# EAGLE design kilafors_rev_a (EAGLE 6.6.0)
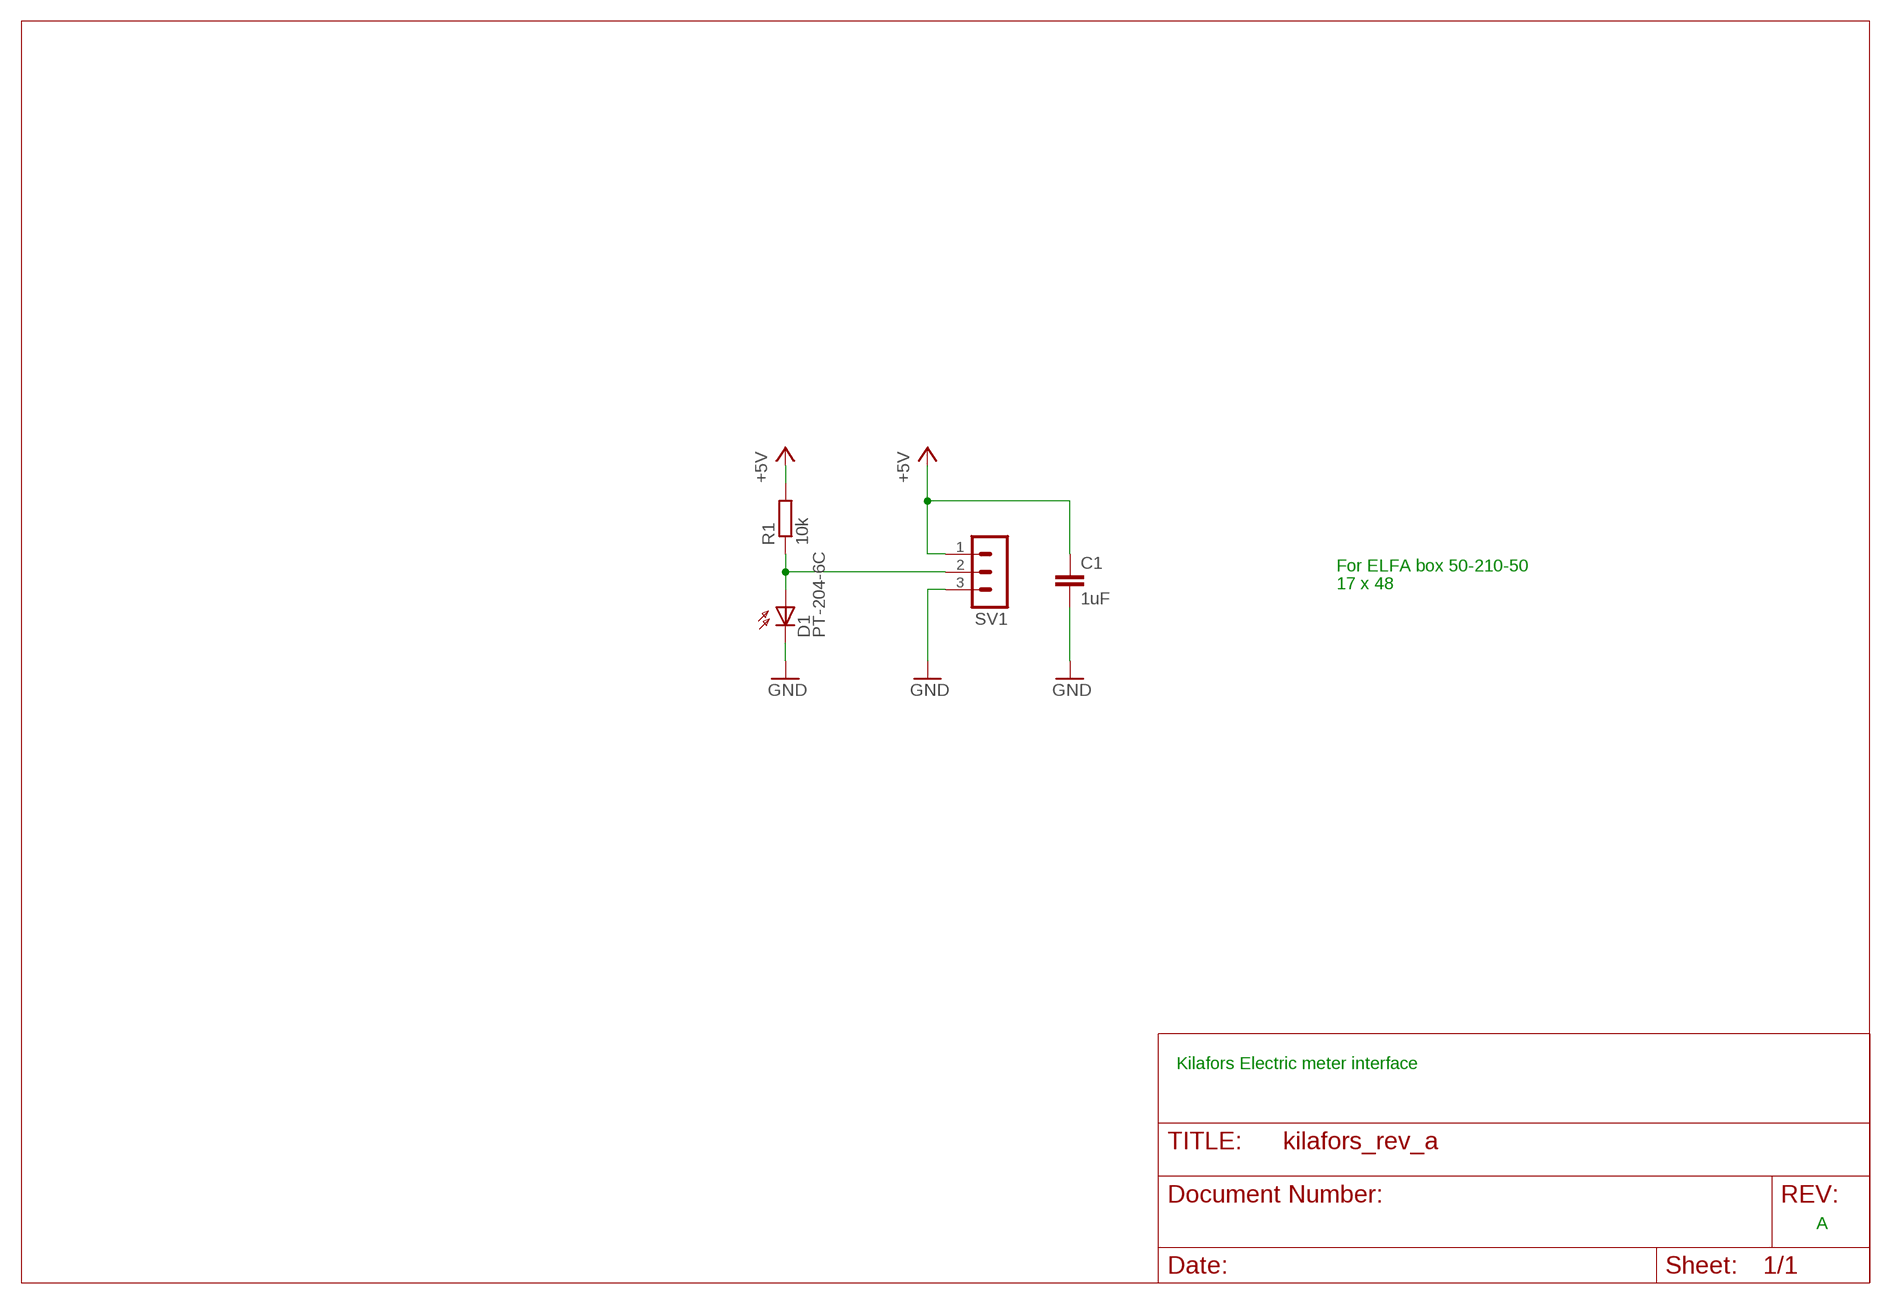
[diagram p0: schematic, sheet 1]

## Parts
C1  1uF  C-EUC0805  [C0805]
D1  PT-204-6C  BP104  [BP104]
R1  10k  R-EU_R0805  [R0805]
SV1  MA03-1  [MA03-1]

## Nets
+5V: C1.1 R1.2 SV1.1
GND: C1.2 D1.K(C) SV1.3
N$1: D1.A R1.1 SV1.2

## Notes on the sheet
- For ELFA box 50-210-50
- 17 x 48
- Kilafors Electric meter interface
- A

## Library data of the parts
C1 = rcl:C-EU: CAPACITOR, European symbol
D1 = opto-trans-siemens:BP104: PHOTO DIODE; MF: VISHAY/TELEFUNKEN; MPN: BP104; OC_FARNELL: 1779636; OC_NEWARK: 14M4504
R1 = rcl:R-EU_: RESISTOR, European symbol
SV1 = con-lstb:MA03-1: PIN HEADER; OC_FARNELL: unknown; OC_NEWARK: unknown

## Board
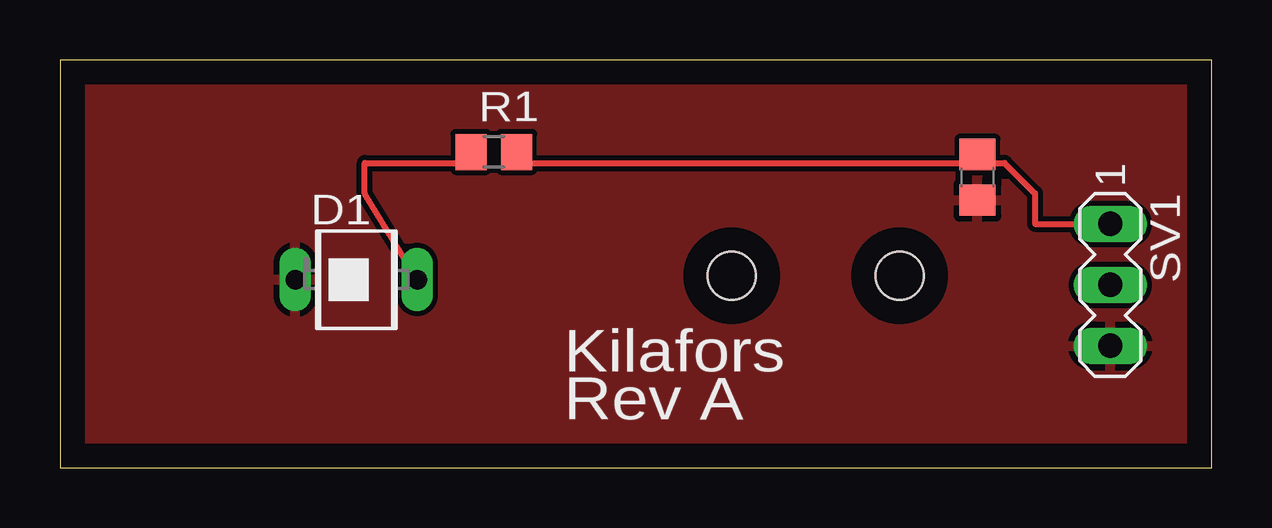
[diagram p1: board, top side]
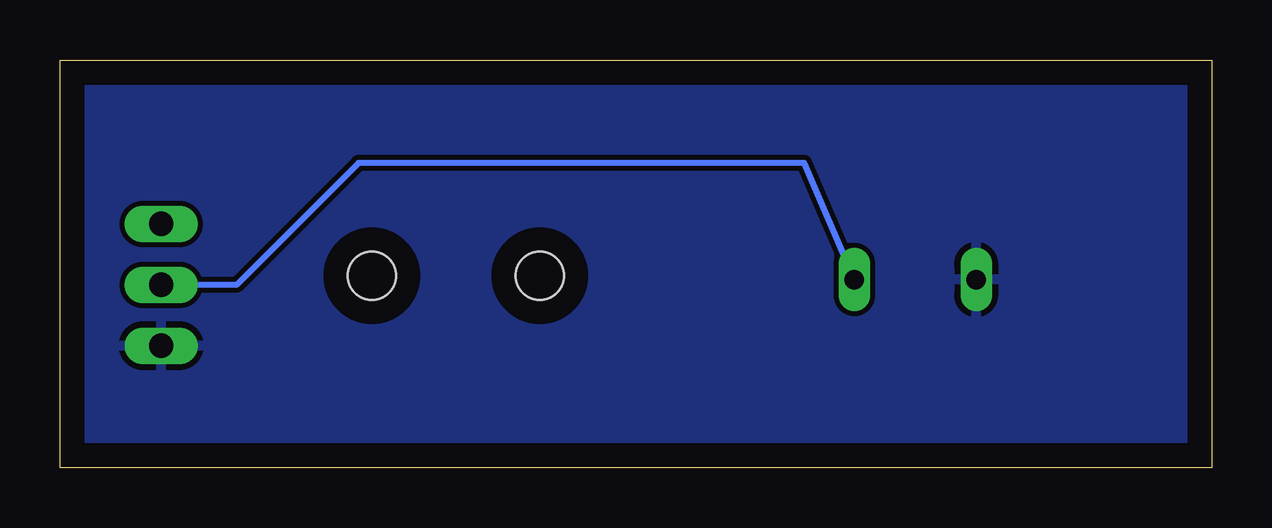
[diagram p2: board, bottom side, seen from below]

Size 48 x 17 mm. Coordinates in mm from the lower left corner, seen from the top.
Outline: 0,0 48,0 48,17 0,17 0,0
Copper layers (1*16): Top 0.035mm / dielectric 1.5mm / Bottom 0.035mm
Design rules "default": minimum track width 10mil, minimum drill 24mil, track to track 8mil, track to pad 8mil, pad to pad 8mil, via to via 8mil, smd to smd 8mil, copper to edge 40mil, drill to drill 8mil, minimum pad ring 10mil, minimum via ring 8mil, stop-mask expansion 4mil, vias tented up to drill 0mil, thermal gap 10mil
Holes 2 mm at 28,8 35,8

### Footprints (pad centres in the part's own frame; a part is rotated, then mirrored left to right if it is on the bottom)
C0805 = smd 1.3 x 1.5: 1 -0.95,0; 2 0.95,0
BP104 = drill 0.813 long: A 0,2.54; K 0,-2.54
R0805 = smd 1.3 x 1.5: 1 -0.95,0; 2 0.95,0
MA03-1 = drill 1.016 long: 1 -2.54,0; 2 0,0; 3 2.54,0

### Placement (x,y rotation side)
C1  38.24,12.11 270 top
D1  12.35,7.84 270 top
R1  18.08,13.16 0 top
SV1  43.78,7.62 270 top

### Tracks (layer width: path | path; a pad name or v marks a point on that pad's centre or on a via)
+5V
  Top 0.254: 38.1,12.7 19.05,12.7 R1.2 | 38.1,12.7 39.37,12.7 40.64,11.43 40.64,10.16 SV1.1 | 38.1,12.7 C1.1
GND
  pour Bottom: -1,17 -1,-1 49,-1 49,18
  pour Top: 0,18 0,-1 49,-1 49,18
N$1
  Top 0.254: R1.1 16.51,12.7 12.7,12.7 12.7,11.43 D1.A
  Bottom 0.254: SV1.2 40.64,7.62 35.56,12.7 16.97,12.7 D1.A

### Text on the board
tNames: Kilafors | Rev A